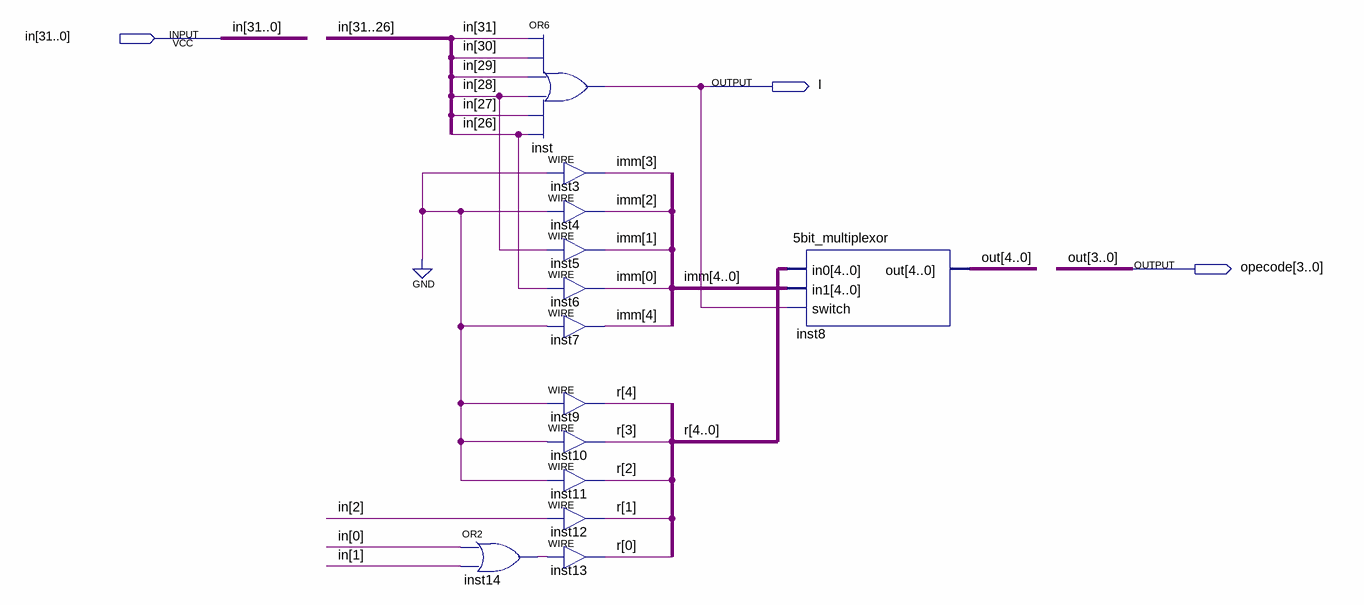
[diagram p0: schematic sheet]
// Quartus schematic commandor.bdf as structural Verilog: 13 symbols, 3 pins
module commandor (
  input  [31:0] in,
  output I,
  output [3:0] opecode
);

  wire inst14_out;
  wire [4:0] imm, r;
  wire [4:4] out;

  or inst14 (inst14_out, in[0], in[1]);
  or inst (I, in[31], in[30], in[29], in[28], in[27], in[26]);
  assign imm[3] = 1'b0;  // WIRE inst3
  assign imm[2] = 1'b0;  // WIRE inst4
  assign imm[1] = in[28];  // WIRE inst5
  assign imm[0] = in[26];  // WIRE inst6
  assign imm[4] = 1'b0;  // WIRE inst7
  assign r[4] = 1'b0;  // WIRE inst9
  assign r[3] = 1'b0;  // WIRE inst10
  assign r[2] = 1'b0;  // WIRE inst11
  assign r[1] = in[2];  // WIRE inst12
  assign r[0] = inst14_out;  // WIRE inst13
  \5bit_multiplexor  inst8 (.in0(r), .in1(imm), .switch(I), .out({out[4], opecode}));

  // Other names for the same wires on the sheet: out[3:0] = opecode
endmodule
